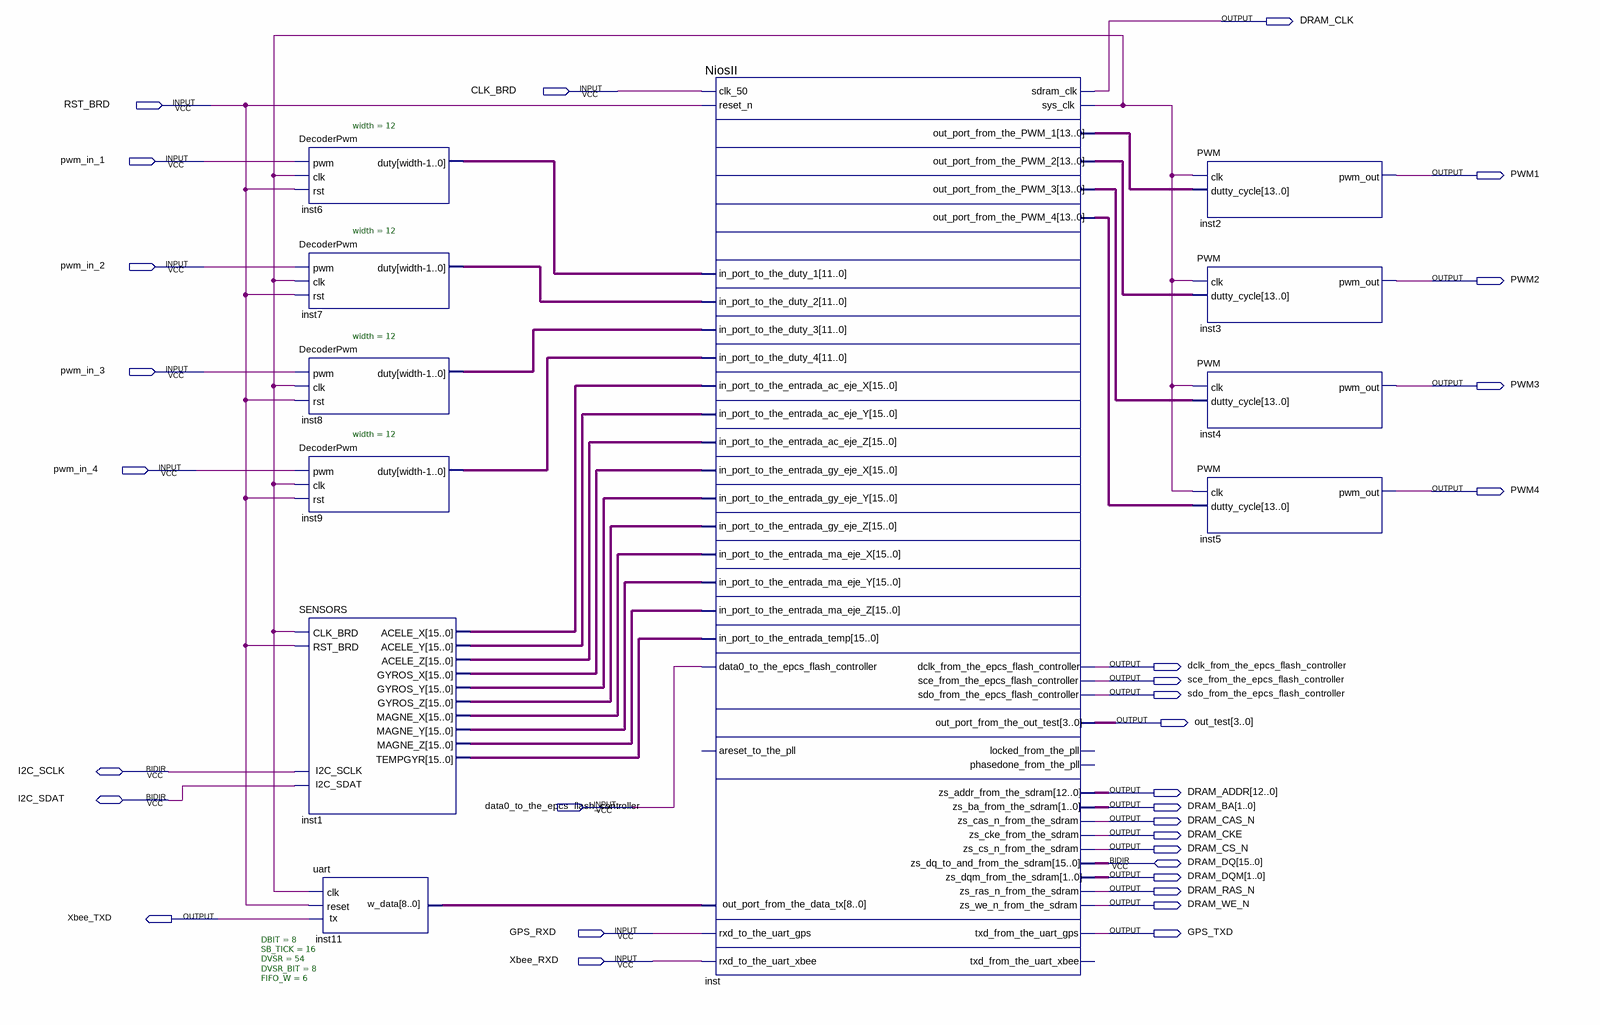
[diagram p0: schematic sheet]
// Quartus schematic Quad.bdf as structural Verilog: 11 symbols, 31 pins
module Quad (
  input  CLK_BRD,
  input  RST_BRD,
  input  pwm_in_1,
  input  pwm_in_2,
  input  pwm_in_3,
  input  pwm_in_4,
  input  data0_to_the_epcs_flash_controller,
  input  GPS_RXD,
  input  Xbee_RXD,
  inout  I2C_SCLK,
  inout  I2C_SDAT,
  inout  [15:0] DRAM_DQ,
  output DRAM_CLK,
  output PWM1,
  output PWM2,
  output PWM3,
  output PWM4,
  output dclk_from_the_epcs_flash_controller,
  output sce_from_the_epcs_flash_controller,
  output sdo_from_the_epcs_flash_controller,
  output [3:0] out_test,
  output [12:0] DRAM_ADDR,
  output [1:0] DRAM_BA,
  output DRAM_CAS_N,
  output DRAM_CKE,
  output DRAM_CS_N,
  output [1:0] DRAM_DQM,
  output DRAM_RAS_N,
  output DRAM_WE_N,
  output Xbee_TXD,
  output GPS_TXD
);

  wire inst_sys_clk;
  wire [8:0] inst_out_port_from_the_data_tx;
  wire [11:0] inst6_duty, inst7_duty, inst8_duty, inst9_duty;
  wire [13:0] inst_out_port_from_the_pwm_1, inst_out_port_from_the_pwm_2, inst_out_port_from_the_pwm_3,
       inst_out_port_from_the_pwm_4;
  wire [15:0] inst1_acele_x, inst1_acele_y, inst1_acele_z, inst1_gyros_x, inst1_gyros_y, inst1_gyros_z,
       inst1_magne_x, inst1_magne_y, inst1_magne_z, inst1_tempgyr;

  DecoderPwm #(.width(12)) inst6 (.pwm(pwm_in_1), .clk(inst_sys_clk), .rst(RST_BRD), .duty(inst6_duty));
  DecoderPwm #(.width(12)) inst7 (.pwm(pwm_in_2), .clk(inst_sys_clk), .rst(RST_BRD), .duty(inst7_duty));
  DecoderPwm #(.width(12)) inst8 (.pwm(pwm_in_3), .clk(inst_sys_clk), .rst(RST_BRD), .duty(inst8_duty));
  DecoderPwm #(.width(12)) inst9 (.pwm(pwm_in_4), .clk(inst_sys_clk), .rst(RST_BRD), .duty(inst9_duty));
  SENSORS inst1 (
    .CLK_BRD(inst_sys_clk), .RST_BRD(RST_BRD), .ACELE_X(inst1_acele_x), .ACELE_Y(inst1_acele_y),
    .ACELE_Z(inst1_acele_z), .GYROS_X(inst1_gyros_x), .GYROS_Y(inst1_gyros_y), .GYROS_Z(inst1_gyros_z),
    .MAGNE_X(inst1_magne_x), .MAGNE_Y(inst1_magne_y), .MAGNE_Z(inst1_magne_z), .TEMPGYR(inst1_tempgyr),
    .I2C_SCLK(I2C_SCLK), .I2C_SDAT(I2C_SDAT));
  uart #(.DBIT(8), .SB_TICK(16), .DVSR(54), .DVSR_BIT(8), .FIFO_W(6)) inst11 (
    .clk(inst_sys_clk), .reset(RST_BRD), .w_data(inst_out_port_from_the_data_tx), .tx(Xbee_TXD));
  NiosII inst (
    .clk_50(CLK_BRD), .reset_n(RST_BRD), .in_port_to_the_duty_1(inst6_duty),
    .in_port_to_the_duty_2(inst7_duty), .in_port_to_the_duty_3(inst8_duty),
    .in_port_to_the_duty_4(inst9_duty), .in_port_to_the_entrada_ac_eje_X(inst1_acele_x),
    .in_port_to_the_entrada_ac_eje_Y(inst1_acele_y), .in_port_to_the_entrada_ac_eje_Z(inst1_acele_z),
    .in_port_to_the_entrada_gy_eje_X(inst1_gyros_x), .in_port_to_the_entrada_gy_eje_Y(inst1_gyros_y),
    .in_port_to_the_entrada_gy_eje_Z(inst1_gyros_z), .in_port_to_the_entrada_ma_eje_X(inst1_magne_x),
    .in_port_to_the_entrada_ma_eje_Y(inst1_magne_y), .in_port_to_the_entrada_ma_eje_Z(inst1_magne_z),
    .in_port_to_the_entrada_temp(inst1_tempgyr),
    .data0_to_the_epcs_flash_controller(data0_to_the_epcs_flash_controller), .rxd_to_the_uart_gps(GPS_RXD),
    .rxd_to_the_uart_xbee(Xbee_RXD), .sdram_clk(DRAM_CLK), .sys_clk(inst_sys_clk),
    .out_port_from_the_PWM_1(inst_out_port_from_the_pwm_1),
    .out_port_from_the_PWM_2(inst_out_port_from_the_pwm_2),
    .out_port_from_the_PWM_3(inst_out_port_from_the_pwm_3),
    .out_port_from_the_PWM_4(inst_out_port_from_the_pwm_4),
    .out_port_from_the_data_tx(inst_out_port_from_the_data_tx),
    .dclk_from_the_epcs_flash_controller(dclk_from_the_epcs_flash_controller),
    .sce_from_the_epcs_flash_controller(sce_from_the_epcs_flash_controller),
    .sdo_from_the_epcs_flash_controller(sdo_from_the_epcs_flash_controller),
    .out_port_from_the_out_test(out_test), .zs_addr_from_the_sdram(DRAM_ADDR),
    .zs_ba_from_the_sdram(DRAM_BA), .zs_cas_n_from_the_sdram(DRAM_CAS_N), .zs_cke_from_the_sdram(DRAM_CKE),
    .zs_cs_n_from_the_sdram(DRAM_CS_N), .zs_dqm_from_the_sdram(DRAM_DQM),
    .zs_ras_n_from_the_sdram(DRAM_RAS_N), .zs_we_n_from_the_sdram(DRAM_WE_N),
    .txd_from_the_uart_gps(GPS_TXD), .zs_dq_to_and_from_the_sdram(DRAM_DQ));  // open: areset_to_the_pll, locked_from_the_pll, phasedone_from_the_pll, txd_from_the_uart_xbee
  PWM inst2 (.clk(inst_sys_clk), .dutty_cycle(inst_out_port_from_the_pwm_1), .pwm_out(PWM1));
  PWM inst3 (.clk(inst_sys_clk), .dutty_cycle(inst_out_port_from_the_pwm_2), .pwm_out(PWM2));
  PWM inst4 (.clk(inst_sys_clk), .dutty_cycle(inst_out_port_from_the_pwm_3), .pwm_out(PWM3));
  PWM inst5 (.clk(inst_sys_clk), .dutty_cycle(inst_out_port_from_the_pwm_4), .pwm_out(PWM4));
endmodule
